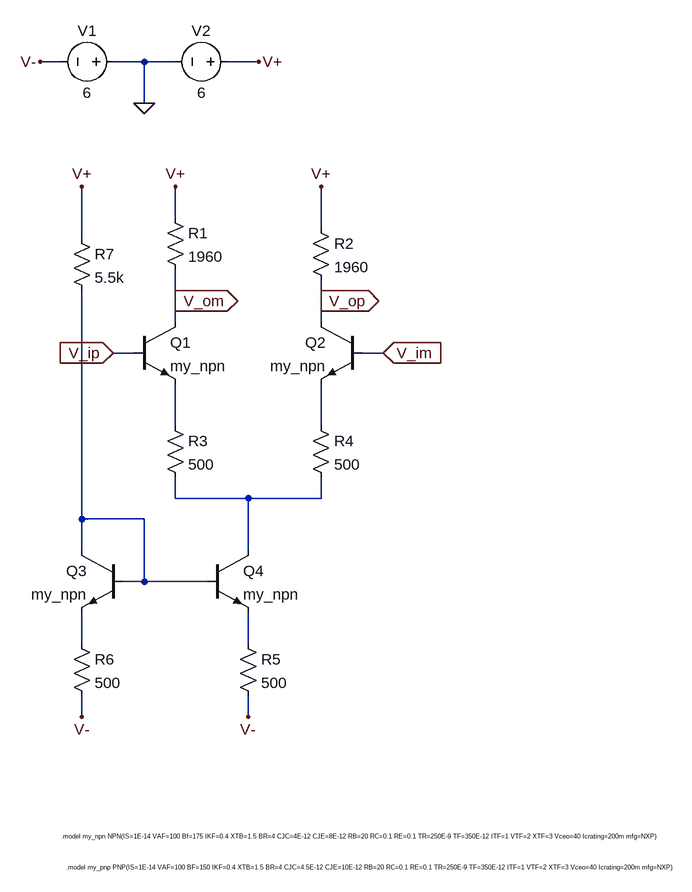
[diagram p0: schematic differential_stage.asc]
differential_stage.asc, the LTspice schematic file:
Version 4
SHEET 1 2800 768
WIRE -176 -480 -208 -480
WIRE -48 -480 -96 -480
WIRE 0 -480 -48 -480
WIRE 128 -480 80 -480
WIRE -48 -416 -48 -480
WIRE 0 -240 0 -288
WIRE 224 -224 224 -288
WIRE -144 -208 -144 -288
WIRE 0 -112 0 -160
WIRE 224 -112 224 -144
WIRE 0 -80 0 -112
WIRE 224 -80 224 -112
WIRE -64 -32 -96 -32
WIRE 320 -32 288 -32
WIRE 0 80 0 16
WIRE 224 80 224 16
WIRE 0 192 0 160
WIRE 112 192 0 192
WIRE 224 192 224 160
WIRE 224 192 112 192
WIRE -144 224 -144 -128
WIRE -48 224 -144 224
WIRE -144 272 -144 224
WIRE 112 272 112 192
WIRE -48 320 -48 224
WIRE -48 320 -80 320
WIRE 48 320 -48 320
WIRE -144 416 -144 368
WIRE 112 416 112 368
WIRE -144 528 -144 496
WIRE 112 528 112 496
FLAG 128 -480 V+
FLAG -208 -480 V-
FLAG -48 -416 0
FLAG -144 -288 V+
FLAG -144 528 V-
FLAG 224 -112 V_op
IOPIN 224 -112 Out
FLAG 112 528 V-
FLAG 0 -288 V+
FLAG 224 -288 V+
FLAG 320 -32 V_im
IOPIN 320 -32 In
FLAG -96 -32 V_ip
IOPIN -96 -32 In
FLAG 0 -112 V_om
IOPIN 0 -112 Out
SYMBOL npn -64 -80 R0
SYMATTR InstName Q1
SYMATTR Value my_npn
SYMBOL Voltage -80 -480 R90
WINDOW 0 -32 56 VBottom 2
WINDOW 3 32 56 VTop 2
SYMATTR InstName V1
SYMATTR Value 6
SYMBOL Voltage 96 -480 R90
WINDOW 0 -32 56 VBottom 2
WINDOW 3 32 56 VTop 2
SYMATTR InstName V2
SYMATTR Value 6
SYMBOL npn 48 272 R0
SYMATTR InstName Q4
SYMATTR Value my_npn
SYMBOL npn 288 -80 M0
SYMATTR InstName Q2
SYMATTR Value my_npn
SYMBOL npn -80 272 M0
SYMATTR InstName Q3
SYMATTR Value my_npn
SYMBOL Res -16 -256 R0
SYMATTR InstName R1
SYMATTR Value 1960
SYMBOL Res 208 -240 R0
SYMATTR InstName R2
SYMATTR Value 1960
SYMBOL Res -16 64 R0
SYMATTR InstName R3
SYMATTR Value 500
SYMBOL Res 208 64 R0
SYMATTR InstName R4
SYMATTR Value 500
SYMBOL Res 96 400 R0
SYMATTR InstName R5
SYMATTR Value 500
SYMBOL Res -160 400 R0
SYMATTR InstName R6
SYMATTR Value 500
SYMBOL Res -160 -224 R0
SYMATTR InstName R7
SYMATTR Value 5.5k
TEXT -176 712 Left 0 !.model my_npn NPN(IS=1E-14 VAF=100 Bf=175 IKF=0.4 XTB=1.5 BR=4 CJC=4E-12 CJE=8E-12 RB=20 RC=0.1 RE=0.1 TR=250E-9 TF=350E-12 ITF=1 VTF=2 XTF=3 Vceo=40 Icrating=200m mfg=NXP)
TEXT -168 760 Left 0 !.model my_pnp PNP(IS=1E-14 VAF=100 BF=150 IKF=0.4 XTB=1.5 BR=4 CJC=4.5E-12 CJE=10E-12 RB=20 RC=0.1 RE=0.1 TR=250E-9 TF=350E-12 ITF=1 VTF=2 XTF=3 Vceo=40 Icrating=200m mfg=NXP)

The netlist it stands for:
* differential_stage.asc
Q1 V_om V_ip N001 0 my_npn
V1 0 V- 6
V2 V+ 0 6
Q4 N003 N004 N006 0 my_npn
Q2 V_op V_im N002 0 my_npn
Q3 N004 N004 N005 0 my_npn
R1 V+ V_om 1960
R2 V+ V_op 1960
R3 N001 N003 500
R4 N002 N003 500
R5 N006 V- 500
R6 N005 V- 500
R7 V+ N004 5.5k
.model NPN NPN
.model PNP PNP
.lib standard.bjt
.model my_npn NPN(IS=1E-14 VAF=100 Bf=175 IKF=0.4 XTB=1.5 BR=4 CJC=4E-12 CJE=8E-12 RB=20 RC=0.1 RE=0.1 TR=250E-9 TF=350E-12 ITF=1 VTF=2 XTF=3 Vceo=40 Icrating=200m mfg=NXP)
.model my_pnp PNP(IS=1E-14 VAF=100 BF=150 IKF=0.4 XTB=1.5 BR=4 CJC=4.5E-12 CJE=10E-12 RB=20 RC=0.1 RE=0.1 TR=250E-9 TF=350E-12 ITF=1 VTF=2 XTF=3 Vceo=40 Icrating=200m mfg=NXP)
.backanno
.end